# EAGLE design SD Card v4.0a (EAGLE 6.1)
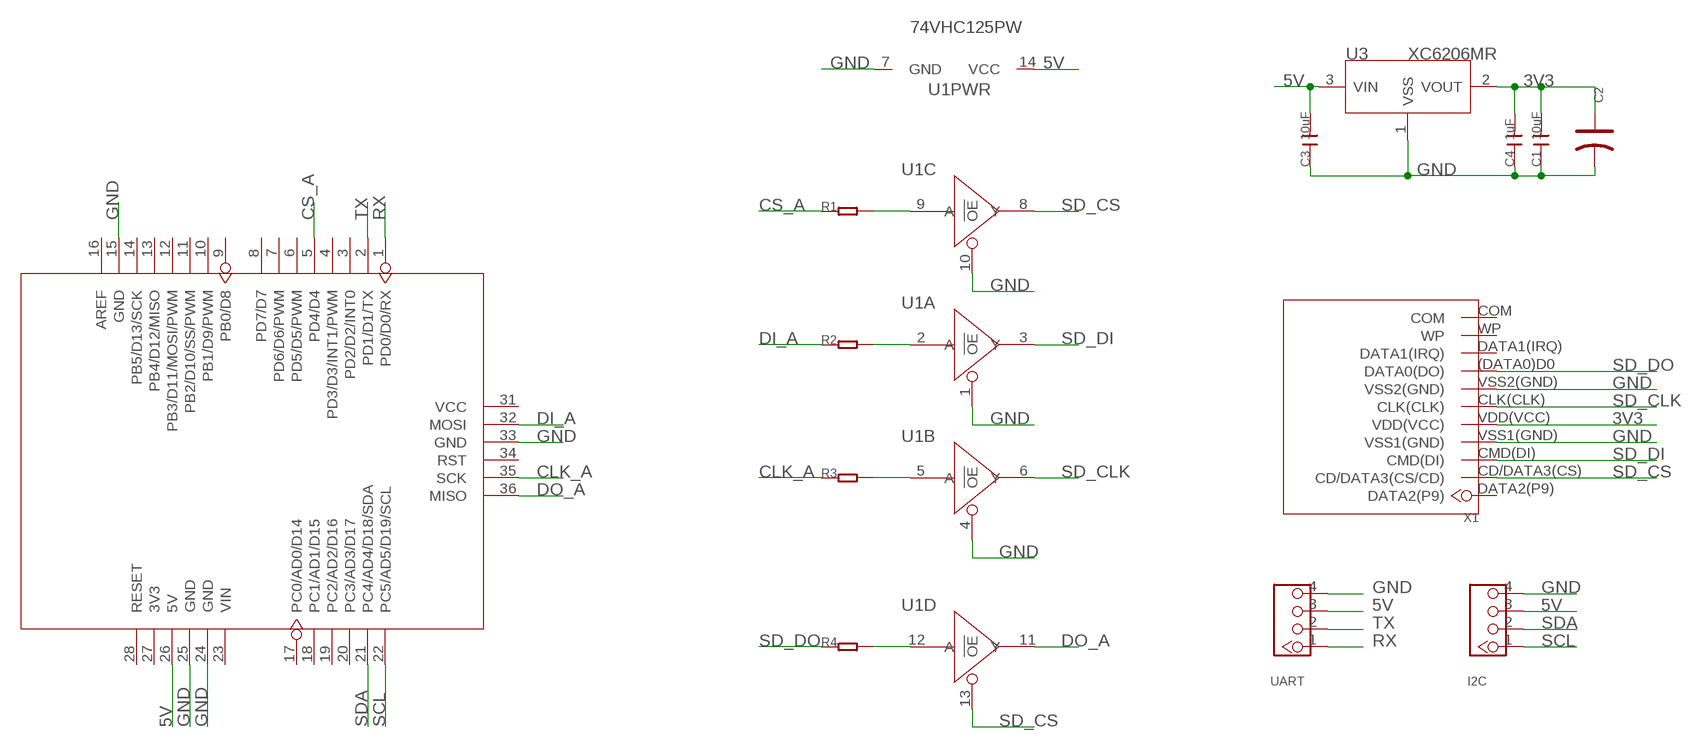
[diagram p0: schematic, sheet 1]

## Parts
C1  10uF  C-0805  [C0805]
C2  CAP-AVX-A  [AVX-A]
C3  10uF  C-0805  [C0805]
C4  1uF  C-0805  [C0805]
I2C  TWIG-4P-2.0-2.0  [4P-2.0]
R1  R-0603  [R0603]
R2  R-0603  [R0603]
R3  R-0603  [R0603]
R4  R-0603  [R0603]
U1  74VHC125PW  [TSSOP14]
U2  ARDUINO'W/-SILK  [ARDUINO]
U3  XC6206MR  [SOT23]
UART  TWIG-4P-2.0-2.0  [4P-2.0]
X1  SDCARDEXTDEVICE  [SDCARDEXTPACKAGE]

## Nets
3V3: C1.2 C2.+ C4.2 U3.2(VOUT) X1.VDD(VCC)
5V: C3.2 I2C.3 U1.14(PWR:VCC) U2.26(5V) U3.3(VIN) UART.3
CLK_A: R3.1 U2.35(SCK)
CS_A: R1.1 U2.5(PD4/D4)
DI_A: R2.1 U2.32(MOSI)
DO_A: U1.11(D:Y) U2.36(MISO)
GND: C1.1 C2.- C3.1 C4.1 I2C.4 U1.1(A:!OE) U1.4(B:!OE) U1.7(PWR:GND) U1.10(C:!OE) U2.15(GND) U2.24(GND) U2.25(GND) U2.33(GND) U3.1(VSS) UART.4 X1.VSS1(GND) X1.VSS2(GND)
N$2: R4.2 U1.12(D:A)
N$3: R3.2 U1.5(B:A)
N$4: R2.2 U1.2(A:A)
N$5: R1.2 U1.9(C:A)
RX: U2.1(PD0/D0/RX) UART.1
SCL: I2C.1 U2.22(PC5/AD5/D19/SCL)
SD_CLK: U1.6(B:Y) X1.CLK(CLK)
SD_CS: U1.8(C:Y) U1.13(D:!OE) X1.CD/DATA3(CS)(CD/DATA3(CS/CD))
SD_DI: U1.3(A:Y) X1.CMD(DI)
SD_DO: R4.1 X1.(DATA0)D0(DATA0(DO))
SDA: I2C.2 U2.21(PC4/AD4/D18/SDA)
TX: U2.2(PD1/D1/TX) UART.2
Unconnected: U2.3(PD2/D2/INT0) U2.4(PD3/D3/INT1/PWM) U2.6(PD5/D5/PWM) U2.7(PD6/D6/PWM) U2.8(PD7/D7) U2.9(PB0/D8) U2.10(PB1/D9/PWM) U2.11(PB2/D10/SS/PWM) U2.12(PB3/D11/MOSI/PWM) U2.13(PB4/D12/MISO) U2.14(PB5/D13/SCK) U2.16(AREF) U2.17(PC0/AD0/D14) U2.18(PC1/AD1/D15) U2.19(PC2/AD2/D16) U2.20(PC3/AD3/D17) U2.23(VIN) U2.27(3V3) U2.28(RESET) U2.31(VCC) U2.34(RST) X1.COM X1.DATA1(IRQ) X1.DATA2(P9) X1.WP

## Library data of the parts
C1 C3 C4 = Discrete:C*: Ceramic Capacitors
C2 = Discrete:CAP*: Electrolytic Capacitors,Tantalum Capacitors and Super Capacitors
I2C UART = Connector:TWIG-4P-2.0
R1-R4 = Discrete:R*
U1 = IC:74V*125: Quad Buffer/Line Driver;3-state
U2 = moudle:ARDUINO
U3 = IC:XC6206: LOW ESR Cap.Compatible Positive Voltage Regulators
X1 = SD card breakout:SDCARDEXTDEVICE

## Net classes
0 default: clearance 0.152 mm

## Board
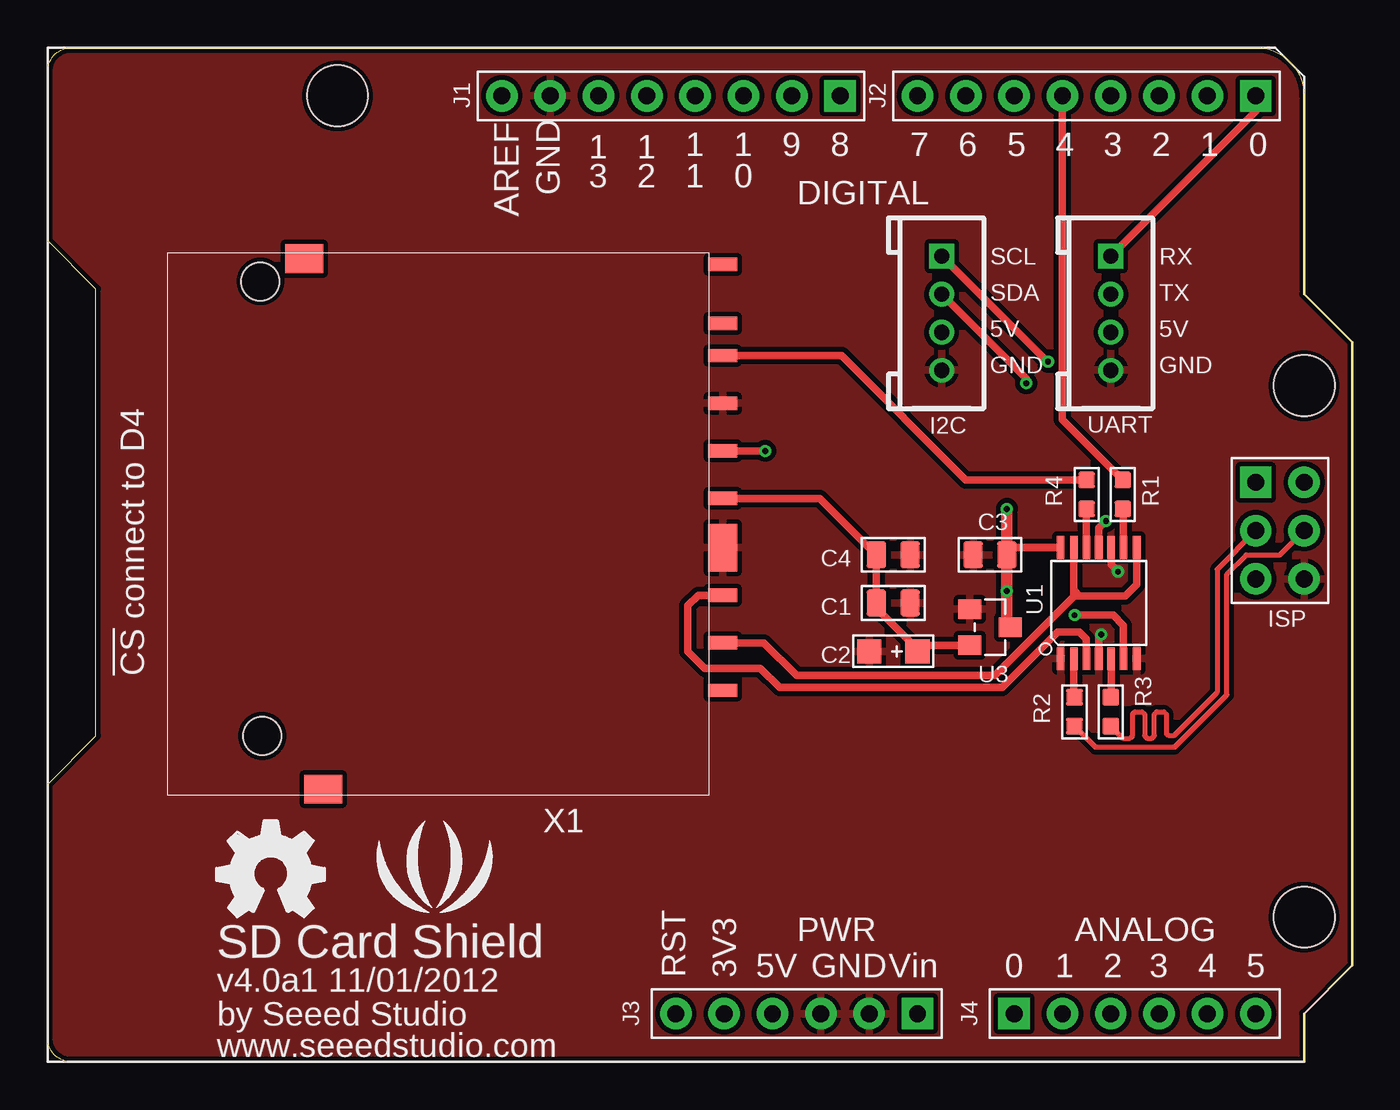
[diagram p1: board, top side]
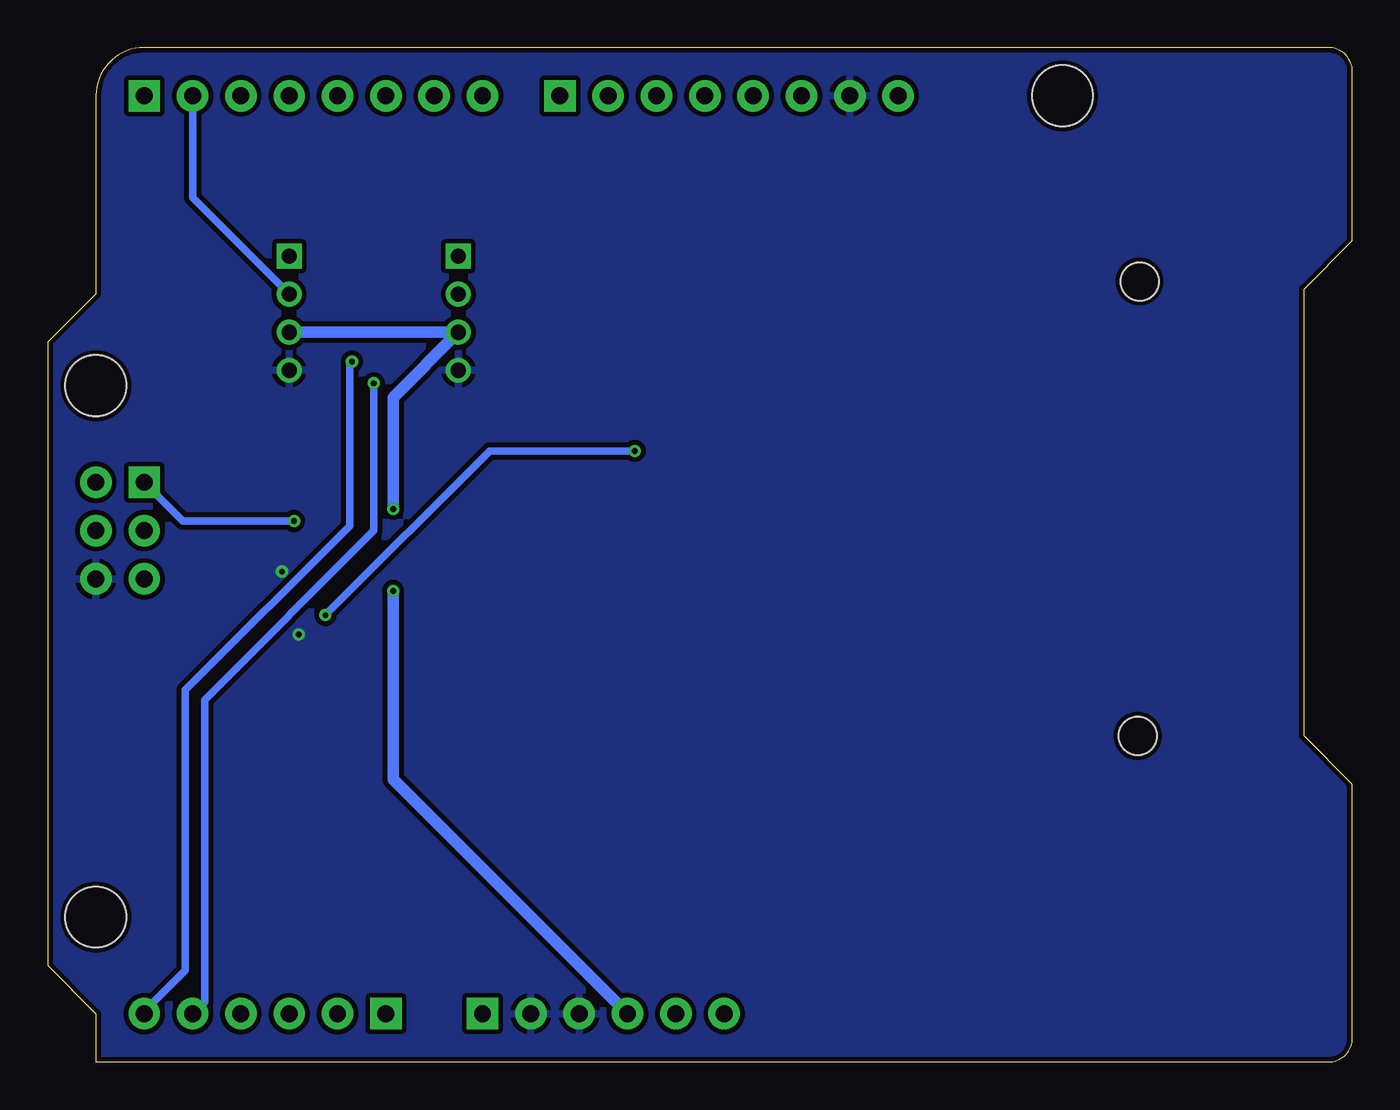
[diagram p2: board, bottom side, seen from below]

Size 68.58 x 53.34 mm. Coordinates in mm from the lower left corner, seen from the top.
Outline: 0,43.18 0,52.07 arc-90 1.27,53.34 63.5,53.34 arc-90 66.04,50.8 66.04,40.39 68.58,37.85 68.58,5.08 66.04,2.54 66.04,0 1.27,0 arc-90 0,1.27 0,14.61 2.54,17.14 2.54,40.64 0,43.18
Copper layers (1*16): Top 0.035mm / dielectric 1.5mm / Bottom 0.035mm
Design rules: minimum track width 6mil, minimum drill 12mil, track to track 6mil, track to pad 6mil, pad to pad 6mil, via to via 6mil, smd to smd 0mil, copper to edge 10mil, drill to drill 10mil, minimum pad ring 10mil, minimum via ring 6mil, stop-mask expansion 2mil, vias tented up to drill 100mil, thermal gap 10mil
tKeepout: area 52.7,26.8 to 59.1,31.9

### Footprints (pad centres in the part's own frame; a part is rotated, then mirrored left to right if it is on the bottom)
C0805 = smd 1.016 x 1.397: 1 -0.889,0; 2 0.889,0
AVX-A = smd 1.27 x 1.27: + -1.27,0; - 1.27,0
4P-2.0 = drill 0.8 pad 1.27 square: 1 -3,0 | drill 0.8 pad 1.27: 2 -1,0; 3 1,0; 4 3,0
R0603 = smd 0.889 x 0.889: 1 -0.762,0; 2 0.762,0
TSSOP14 = smd 0.4 x 1.2: 1 -2,-2.925; 2 -1.3,-2.925; 3 -0.65,-2.925; 4 0,-2.925; 5 0.65,-2.925; 6 1.3,-2.925; 7 2,-2.925; 8 2,2.925; 9 1.3,2.925; 10 0.65,2.925; 11 0,2.925; 12 -0.65,2.925; 13 -1.3,2.925; 14 -2,2.925
ARDUINO = drill 0.889 pad 1.651 square: 1 63.5,50.8; 9 41.656,50.8; 17 50.8,2.54; 23 45.72,2.54; 36 63.5,30.48 | drill 0.889 pad 1.651: 2 60.96,50.8; 3 58.42,50.8; 4 55.88,50.8; 5 53.34,50.8; 6 50.8,50.8; 7 48.26,50.8; 8 45.72,50.8; 10 39.116,50.8; 11 36.576,50.8; 12 34.036,50.8; 13 31.496,50.8; 14 28.956,50.8; 15 26.416,50.8; 16 23.876,50.8; 18 53.34,2.54; 19 55.88,2.54; 20 58.42,2.54; 21 60.96,2.54; 22 63.5,2.54; 24 43.18,2.54; 25 40.64,2.54; 26 38.1,2.54; 27 35.56,2.54; 28 33.02,2.54; 31 66.04,30.48; 32 66.04,27.94; 33 66.04,25.4; 34 63.5,25.4; 35 63.5,27.94 | hole 3.2: 15.24,50.8; 66.04,35.56; 66.04,7.62
SOT23 = smd 1.016 x 1.2: 1 -0.95,-1.06; 2 0.95,-1.06; 3 0,1.06
SDCARDEXTPACKAGE = smd 1.5 x 0.7: (DATA0)D0 -15.8,-9.2; CD/DATA3(CS) -15.8,5.9; CLK(CLK) -15.8,-4.2; CMD(DI) -15.8,3.4; DATA1(IRQ) -15.8,-10.9; DATA2(P9) -15.8,8.4; VDD(VCC) -15.8,-1.7; VSS2(GND) -15.8,-6.7; WP -15.8,-14 | smd 2 x 1.5: COM 6.2,-14.3; P$2 5.2,13.6 | smd 1.5 x 2.5: VSS1(GND) -15.8,0.9 | hole 2: 8.4,10.8; 8.5,-13.1

### Placement (x,y rotation side)
C1  44.45,24.13 180 top
C2  44.45,21.59 180 top
C3  49.53,26.67 0 top
C4  44.45,26.67 180 top
I2C  46.99,39.37 270 top
R1  56.52,29.84 270 top
R2  53.98,18.41 90 top
R3  55.88,18.41 90 top
R4  54.61,29.84 270 top
U1  55.24,24.13 0 top
U2  0,0 0 top
U3  49.53,22.86 270 top
U$1  [OSHW_FILLX200_NOTEXT]  8.89,7.62 0 top
U$2  [LOGO_SILK]  20.32,9.53 0 top
UART  55.88,39.37 270 top
X1  19.68,27.94 180 top

### Tracks (layer width: path | path; a pad name or v marks a point on that pad's centre or on a via)
3V3
  Top 0.406: U3.2 46.04,21.91 C2.+ 45.34,21.97 45.34,22.1 43.69,23.75 43.69,24.13 43.56,24.26 | C1.2 43.56,24.26 | 43.56,24.26 C4.2 40.59,29.64 X1.VDD(VCC)
5V  (via drill 0.3 pad 0.64)
  Top 0.406: U1.14 50.8,27.05 C3.2
  Top 0.61: U3.3 50.42,23.03 v50.42,24.77 C3.2 v50.42,29.08
  Bottom 0.61: UART.3 I2C.3 50.42,34.94 v50.42,29.08 | v50.42,24.77 50.42,14.86 U2.26
CLK_A
  Top 0.254: U2.35 61.47,25.91 61.47,19.43 59.18,17.14 58.93,17.14 58.8,17.27 58.8,18.29 58.67,18.41 58.29,18.41 58.17,18.29 58.17,17.14 58.04,17.02 57.78,17.02 57.66,17.14 57.66,18.29 57.53,18.41 57.15,18.41 57.02,18.29 57.02,17.14 56.9,17.02 56.52,17.02 R3.1
CS_A
  Top 0.406: U2.5 53.34,33.78 R1.1
DI_A
  Top 0.254: R2.1 55.08,16.55 59.22,16.55 61.98,19.3 61.98,25.65 62.99,26.67 64.77,26.67 U2.32
DO_A  (via drill 0.3 pad 0.64)
  Top 0.406: U1.11 55.24,28.07 v55.63,28.45
  Bottom 0.406: v55.63,28.45 61.47,28.45 U2.36
GND  (via drill 0.3 pad 0.64)
  Top 0.406: U1.4 55.24,22.35 v55.37,22.48 | U1.10 55.9,26.15 v56.26,25.78
  pour Bottom (isolate 0.254): 0,53.34 68.58,53.34 68.58,0 0,0
  pour Top (isolate 0.254): 0,53.34 68.58,53.34 68.58,0 0,0
N$2
  Top 0.406: U1.12 54.59,29.07 R4.2
N$3
  Top 0.406: U1.5 55.9,19.19 R3.2
N$4
  Top 0.406: U1.2 53.95,19.21 R2.2
N$5
  Top 0.406: U1.9 56.55,29.05 R1.2
RX
  Top 0.406: U2.1 63.5,49.99 UART.1
SCL  (via drill 0.3 pad 0.64)
  Top 0.406: v52.58,36.83 52.53,36.83 I2C.1
  Bottom 0.406: U2.22 63.5,2.67 62.61,3.56 62.23,3.94 61.34,4.83 61.34,19.56 52.7,28.19 52.7,36.7 v52.58,36.83
SD_CLK  (via drill 0.3 pad 0.64)
  Top 0.406: U1.6 56.55,22.96 56.01,23.5 v53.98,23.5 | v37.72,32.13 35.49,32.13 X1.CLK(CLK)
  Bottom 0.406: v53.98,23.5 45.34,32.13 v37.72,32.13
SD_CS
  Top 0.406: U1.13 53.95,24.49 | 53.95,24.49 49.78,20.32 39.37,20.32 37.65,22.04 X1.CD/DATA3(CS) | U1.8 57.24,25.11 56.64,24.51 54.61,24.51 54.23,24.51 | 54.23,24.51 53.97,24.51 53.95,24.49 | 54.23,24.51 53.98,24.77
SD_DI
  Top 0.406: X1.CMD(DI) 34.19,24.54 33.66,24 33.66,21.59 34.54,20.7 37.47,20.7 38.48,19.68 50.16,19.68 53.09,22.61 54.23,22.61 54.59,22.24 U1.3
SD_DO
  Top 0.406: X1.(DATA0)D0 41.73,37.14 48.26,30.61 R4.1
SDA  (via drill 0.3 pad 0.64)
  Top 0.406: v51.44,35.69 51.44,35.92 I2C.2
  Bottom 0.406: v51.44,35.69 51.44,27.94 60.33,19.05 60.33,3.17 U2.21
TX
  Bottom 0.406: U2.2 60.96,45.45 UART.2

### Text on the board
tPlace: J1 | J2 | DIGITAL | AREF | SCL | RX | SDA | TX | 5V | 5V | GND | GND | ISP | !CS! connect to D4 | PWR | SD Card Shield | v4.0a1 11/01/2012 | by Seeed Studio | J3 | J4 | www.seeedstudio.com